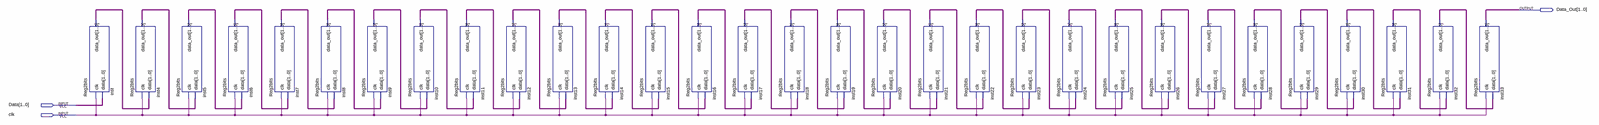
[diagram p0: schematic sheet, whole]
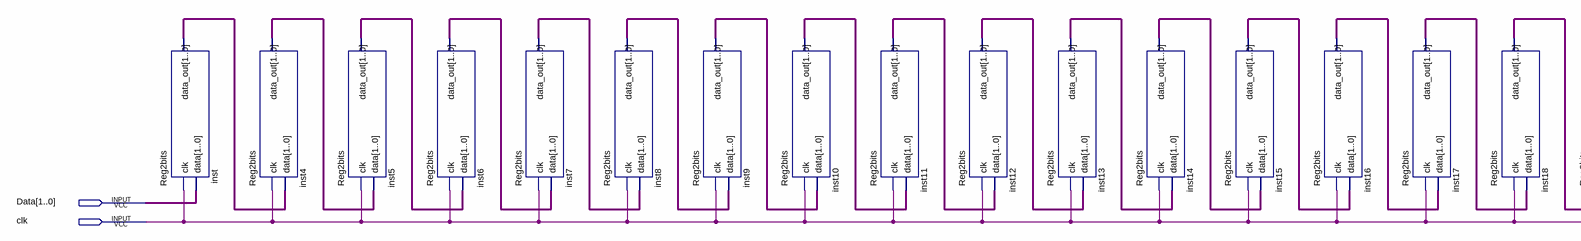
[diagram p1: schematic sheet, left part]
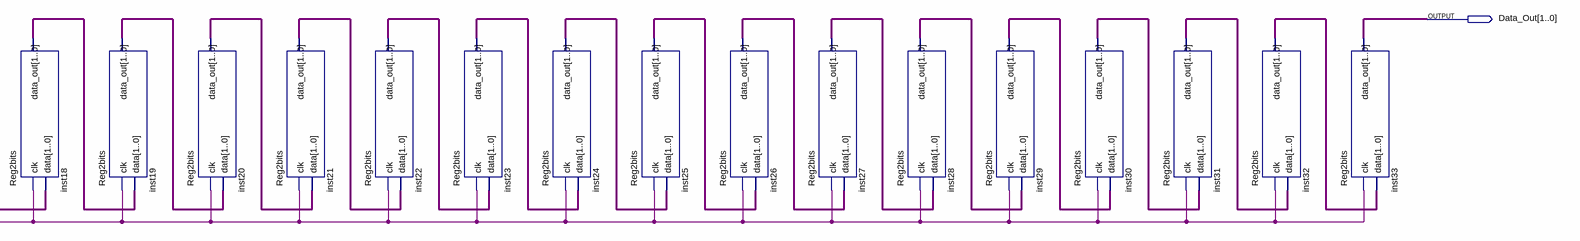
[diagram p2: schematic sheet, right part]
// Quartus schematic Delay_Reg.bdf as structural Verilog: 31 symbols, 3 pins
module Delay_Reg (
  input  [1:0] Data,
  input  clk,
  output [1:0] Data_Out
);

  wire [1:0] inst4_data_out, inst5_data_out, inst6_data_out, inst7_data_out, inst8_data_out, inst9_data_out,
       inst10_data_out, inst11_data_out, inst12_data_out, inst13_data_out, inst14_data_out, inst15_data_out,
       inst16_data_out, inst17_data_out, inst18_data_out, inst19_data_out, inst20_data_out, inst21_data_out,
       inst22_data_out, inst23_data_out, inst24_data_out, inst25_data_out, inst26_data_out, inst27_data_out,
       inst28_data_out, inst29_data_out, inst30_data_out, inst31_data_out, inst32_data_out, inst_data_out;

  Reg2bits inst (.clk(clk), .data(Data), .data_out(inst_data_out));
  Reg2bits inst4 (.clk(clk), .data(inst_data_out), .data_out(inst4_data_out));
  Reg2bits inst5 (.clk(clk), .data(inst4_data_out), .data_out(inst5_data_out));
  Reg2bits inst6 (.clk(clk), .data(inst5_data_out), .data_out(inst6_data_out));
  Reg2bits inst7 (.clk(clk), .data(inst6_data_out), .data_out(inst7_data_out));
  Reg2bits inst8 (.clk(clk), .data(inst7_data_out), .data_out(inst8_data_out));
  Reg2bits inst9 (.clk(clk), .data(inst8_data_out), .data_out(inst9_data_out));
  Reg2bits inst10 (.clk(clk), .data(inst9_data_out), .data_out(inst10_data_out));
  Reg2bits inst11 (.clk(clk), .data(inst10_data_out), .data_out(inst11_data_out));
  Reg2bits inst12 (.clk(clk), .data(inst11_data_out), .data_out(inst12_data_out));
  Reg2bits inst13 (.clk(clk), .data(inst12_data_out), .data_out(inst13_data_out));
  Reg2bits inst14 (.clk(clk), .data(inst13_data_out), .data_out(inst14_data_out));
  Reg2bits inst15 (.clk(clk), .data(inst14_data_out), .data_out(inst15_data_out));
  Reg2bits inst16 (.clk(clk), .data(inst15_data_out), .data_out(inst16_data_out));
  Reg2bits inst17 (.clk(clk), .data(inst16_data_out), .data_out(inst17_data_out));
  Reg2bits inst18 (.clk(clk), .data(inst17_data_out), .data_out(inst18_data_out));
  Reg2bits inst19 (.clk(clk), .data(inst18_data_out), .data_out(inst19_data_out));
  Reg2bits inst20 (.clk(clk), .data(inst19_data_out), .data_out(inst20_data_out));
  Reg2bits inst21 (.clk(clk), .data(inst20_data_out), .data_out(inst21_data_out));
  Reg2bits inst22 (.clk(clk), .data(inst21_data_out), .data_out(inst22_data_out));
  Reg2bits inst23 (.clk(clk), .data(inst22_data_out), .data_out(inst23_data_out));
  Reg2bits inst24 (.clk(clk), .data(inst23_data_out), .data_out(inst24_data_out));
  Reg2bits inst25 (.clk(clk), .data(inst24_data_out), .data_out(inst25_data_out));
  Reg2bits inst26 (.clk(clk), .data(inst25_data_out), .data_out(inst26_data_out));
  Reg2bits inst27 (.clk(clk), .data(inst26_data_out), .data_out(inst27_data_out));
  Reg2bits inst28 (.clk(clk), .data(inst27_data_out), .data_out(inst28_data_out));
  Reg2bits inst29 (.clk(clk), .data(inst28_data_out), .data_out(inst29_data_out));
  Reg2bits inst30 (.clk(clk), .data(inst29_data_out), .data_out(inst30_data_out));
  Reg2bits inst31 (.clk(clk), .data(inst30_data_out), .data_out(inst31_data_out));
  Reg2bits inst32 (.clk(clk), .data(inst31_data_out), .data_out(inst32_data_out));
  Reg2bits inst33 (.clk(clk), .data(inst32_data_out), .data_out(Data_Out));
endmodule
